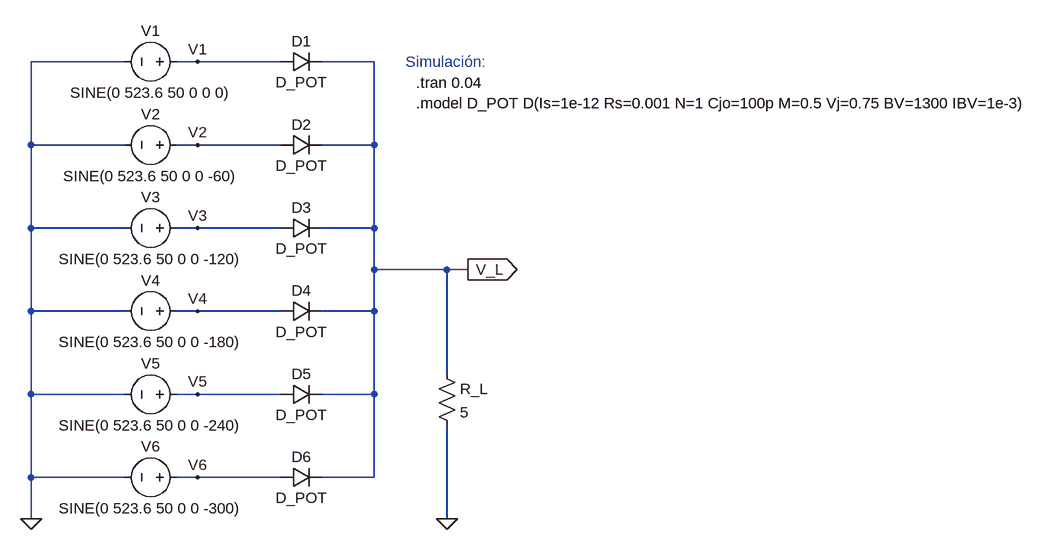
[diagram p0: schematic TPT3 - Circuito Rectificador Hexafásico de Media Onda.asc]
TPT3 - Circuito Rectificador Hexafásico de Media Onda.asc, the LTspice schematic file:
Version 4
SHEET 1 2312 848
WIRE 64 80 -80 80
WIRE 176 80 144 80
WIRE 304 80 176 80
WIRE 448 80 368 80
WIRE -80 208 -80 80
WIRE 64 208 -80 208
WIRE 176 208 144 208
WIRE 304 208 176 208
WIRE 448 208 448 80
WIRE 448 208 368 208
WIRE -80 336 -80 208
WIRE 64 336 -80 336
WIRE 176 336 144 336
WIRE 304 336 176 336
WIRE 448 336 448 208
WIRE 448 336 368 336
WIRE 448 400 448 336
WIRE 560 400 448 400
WIRE 592 400 560 400
WIRE -80 464 -80 336
WIRE 64 464 -80 464
WIRE 176 464 144 464
WIRE 304 464 176 464
WIRE 448 464 448 400
WIRE 448 464 368 464
WIRE 560 560 560 400
WIRE -80 592 -80 464
WIRE 64 592 -80 592
WIRE 176 592 144 592
WIRE 304 592 176 592
WIRE 448 592 448 464
WIRE 448 592 368 592
WIRE -80 720 -80 592
WIRE 64 720 -80 720
WIRE 176 720 144 720
WIRE 304 720 176 720
WIRE 448 720 448 592
WIRE 448 720 368 720
WIRE -80 784 -80 720
WIRE 560 784 560 640
FLAG 560 784 0
FLAG -80 784 0
FLAG 176 80 V1
FLAG 176 208 V2
FLAG 176 336 V3
FLAG 176 464 V4
FLAG 176 592 V5
FLAG 176 720 V6
FLAG 592 400 V_L
IOPIN 592 400 Out
SYMBOL voltage 160 80 R90
WINDOW 0 -32 56 VBottom 2
WINDOW 3 32 56 VTop 2
WINDOW 123 0 0 Left 0
WINDOW 39 0 0 Left 0
SYMATTR InstName V1
SYMATTR Value SINE(0 523.6 50 0 0 0)
SYMBOL voltage 160 208 R90
WINDOW 0 -32 56 VBottom 2
WINDOW 3 32 56 VTop 2
SYMATTR InstName V2
SYMATTR Value SINE(0 523.6 50 0 0 -60)
SYMBOL voltage 160 336 R90
WINDOW 0 -32 56 VBottom 2
WINDOW 3 32 56 VTop 2
SYMATTR InstName V3
SYMATTR Value SINE(0 523.6 50 0 0 -120)
SYMBOL voltage 160 464 R90
WINDOW 0 -32 56 VBottom 2
WINDOW 3 32 56 VTop 2
SYMATTR InstName V4
SYMATTR Value SINE(0 523.6 50 0 0 -180)
SYMBOL voltage 160 592 R90
WINDOW 0 -32 56 VBottom 2
WINDOW 3 32 56 VTop 2
SYMATTR InstName V5
SYMATTR Value SINE(0 523.6 50 0 0 -240)
SYMBOL voltage 160 720 R90
WINDOW 0 -32 56 VBottom 2
WINDOW 3 32 56 VTop 2
SYMATTR InstName V6
SYMATTR Value SINE(0 523.6 50 0 0 -300)
SYMBOL diode 304 96 R270
WINDOW 0 32 32 VTop 2
WINDOW 3 0 32 VBottom 2
SYMATTR InstName D1
SYMATTR Value D_POT
SYMBOL diode 304 224 R270
WINDOW 0 32 32 VTop 2
WINDOW 3 0 32 VBottom 2
SYMATTR InstName D2
SYMATTR Value D_POT
SYMBOL diode 304 352 R270
WINDOW 0 32 32 VTop 2
WINDOW 3 0 32 VBottom 2
SYMATTR InstName D3
SYMATTR Value D_POT
SYMBOL diode 304 480 R270
WINDOW 0 32 32 VTop 2
WINDOW 3 0 32 VBottom 2
SYMATTR InstName D4
SYMATTR Value D_POT
SYMBOL diode 304 608 R270
WINDOW 0 32 32 VTop 2
WINDOW 3 0 32 VBottom 2
SYMATTR InstName D5
SYMATTR Value D_POT
SYMBOL diode 304 736 R270
WINDOW 0 32 32 VTop 2
WINDOW 3 0 32 VBottom 2
SYMATTR InstName D6
SYMATTR Value D_POT
SYMBOL res 544 544 R0
SYMATTR InstName R_L
SYMATTR Value 5
TEXT 512 144 Left 2 !.model D_POT D(Is=1e-12 Rs=0.001 N=1 Cjo=100p M=0.5 Vj=0.75 BV=1300 IBV=1e-3)
TEXT 512 112 Left 2 !.tran 0.04
TEXT 496 80 Left 2 ;Simulación:

The netlist it stands for:
* TPT3 - Circuito Rectificador Hexafásico de Media Onda.asc
V1 V1 0 SINE(0 523.6 50 0 0 0)
V2 V2 0 SINE(0 523.6 50 0 0 -60)
V3 V3 0 SINE(0 523.6 50 0 0 -120)
V4 V4 0 SINE(0 523.6 50 0 0 -180)
V5 V5 0 SINE(0 523.6 50 0 0 -240)
V6 V6 0 SINE(0 523.6 50 0 0 -300)
D1 V1 V_L D_POT
D2 V2 V_L D_POT
D3 V3 V_L D_POT
D4 V4 V_L D_POT
D5 V5 V_L D_POT
D6 V6 V_L D_POT
R_L V_L 0 5
.model D D
.lib standard.dio
.model D_POT D(Is=1e-12 Rs=0.001 N=1 Cjo=100p M=0.5 Vj=0.75 BV=1300 IBV=1e-3)
.tran 0.04
* Simulación:
.backanno
.end

* Results of the author's LTspice run, read from the files saved beside the schematic
* Operating Point, zero values left out:
*   V(v2) = -453.5 V
*   V(v3) = -453.5 V
*   V(v5) = 453.5 V
*   V(v6) = 453.5 V
*   V(v_l) = 452.6 V
*   I(D1) = -453.6 pA
*   I(D2) = -966.3 pA
*   I(D3) = -966.3 pA
*   I(D4) = -453.6 pA
*   I(D5) = 45.26 A
*   I(D6) = 45.26 A
*   I(R_l) = 90.52 A
*   I(V1) = 453.6 pA
*   I(V2) = 989.5 pA
*   I(V3) = 989.5 pA
*   I(V4) = 453.6 pA
*   I(V5) = -45.26 A
*   I(V6) = -45.26 A
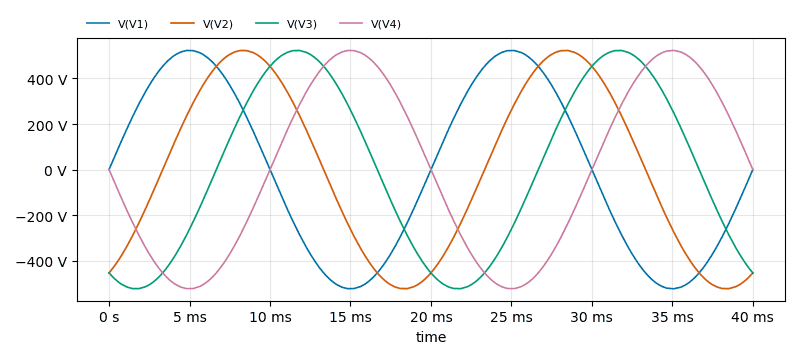
[diagram p1: Transient Analysis of TPT3 - Circuito Rectificador Hexafásico de Media Onda.asc, plotted from the saved traces]
* Transient Analysis, 1 run:
*   V(V1): min -523.4 V, max 522.7 V, average 838.2 µV, rms 370.2 V, last 0 V
*   V(V2): min -522.7 V, max 522.8 V, average 934.1 µV, rms 370.2 V, last -453.5 V
*   V(V3): min -522.8 V, max 522.8 V, average 94.45 µV, rms 370.2 V, last -453.5 V
*   V(V4): min -522.7 V, max 523.4 V, average -838.2 µV, rms 370.2 V, last 0 V